# EAGLE design rx_mod (EAGLE 7.4.0)
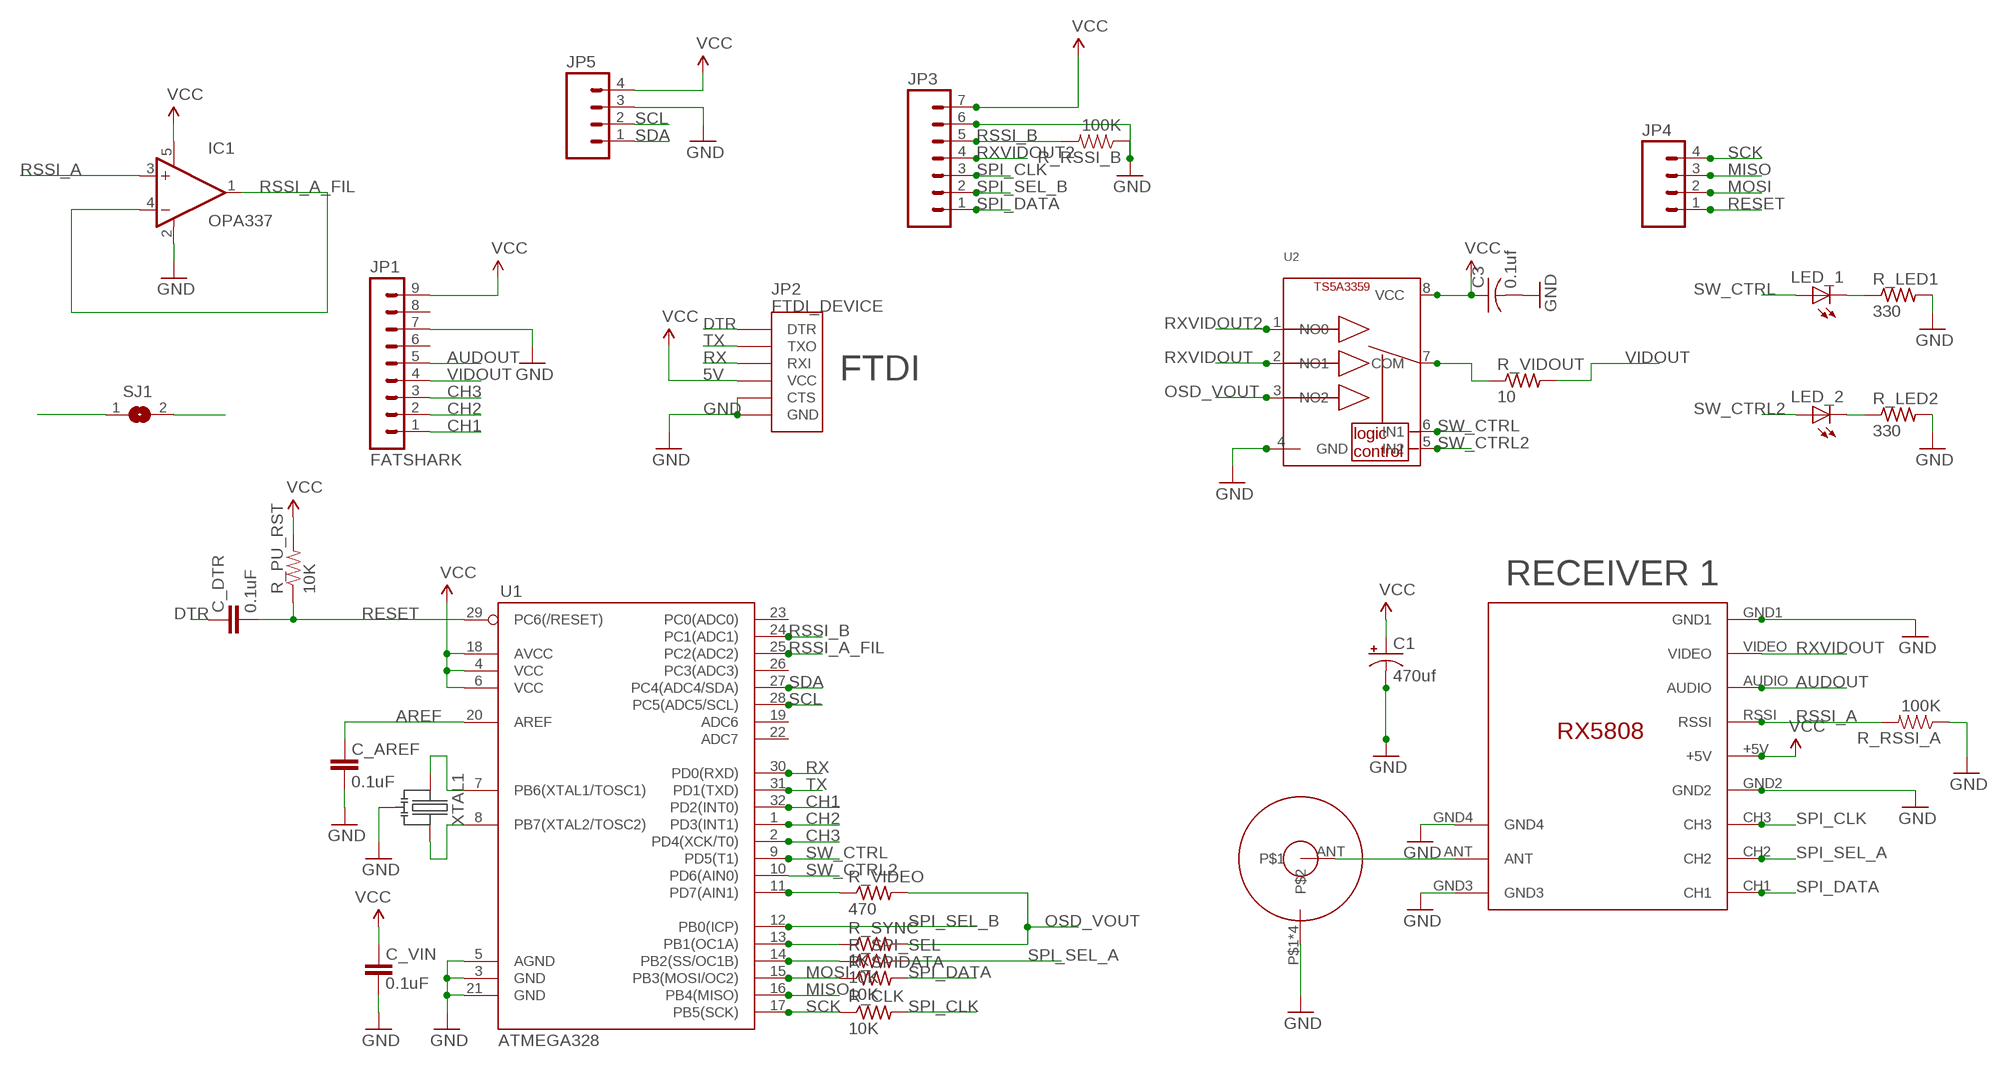
[diagram p0: schematic, sheet 1]

## Parts
C1  470uf  CAP_POL7343  [EIA7343]
C3  0.1uf  C-USC0603  [C0603]
C_AREF  0.1uF  CAP0603-CAP  [0603-CAP]
C_DTR  0.1uF  CAP0603-CAP  [0603-CAP]
C_VIN  0.1uF  CAP0603-CAP  [0603-CAP]
IC1  OPA336N  [SOT23-5]
JP1  FATSHARK  MA09-1  [MA09-1]
JP2  FTDI_DEVICE  [FTDI_DEVICE_SIDE]
JP3  M07  [1X07]
JP4  M04PTH  [1X04]
JP5  M04PTH  [1X04]
LED_1  LEDSML0603  [SML0603]
LED_2  LEDSML0603  [SML0603]
R_CLK  10K  R-US_R0805  [R0805]
R_LED1  330  R-US_R0603  [R0603]
R_LED2  330  R-US_R0603  [R0603]
R_PU_RST  10K  RESISTOR0603-RES  [0603-RES]
R_RSSI_A  100K  RESISTOR0603-RES  [0603-RES]
R_RSSI_B  100K  RESISTOR0603-RES  [0603-RES]
R_SPI_SEL  10K  R-US_R0805  [R0805]
R_SPIDATA  10K  R-US_R0805  [R0805]
R_SYNC  1K  R-US_R0805  [R0805]
R_VIDEO  470  R-US_R0805  [R0805]
R_VIDOUT  10  R-US_R0805  [R0805]
RECEIVER_A  RX5808_A  RX5808  [RX5808]
SJ1  SJ  [SJ]
U1  ATMEGA328  ATMEGA168  [TQFP32-08]
U2  TS5A3359  [VFSOP-8]
U$1  SMA_ANTENNA  [SMA_CONNECTOR]
XTAL1  CSTCE16M0V53-R0  [CSTCE16M0V53-R0]

## Nets
5V: C1.A(+) C3.1 C_VIN.2 IC1.5(V+) JP1.9 JP2.P$4(VCC) JP3.7 JP5.4 R_PU_RST.2 RECEIVER_A.+5V U1.4(VCC) U1.6(VCC) U1.18(AVCC) U2.8(VCC) ; supply symbol labelled VCC
AREF: C_AREF.2 U1.20(AREF)
AUDOUT: JP1.5 RECEIVER_A.AUDIO
CH1: JP1.1 U1.32(PD2(INT0))
CH2: JP1.2 U1.1(PD3(INT1))
CH3: JP1.3 U1.2(PD4(XCK/T0))
DTR: C_DTR.2 JP2.P$1(DTR)
GND: C1.C(-) C3.2 C_AREF.1 C_VIN.1 IC1.2(V-) JP1.7 JP2.P$5(CTS) JP2.P$6(GND) JP3.6 JP5.3 R_LED1.2 R_LED2.2 R_RSSI_A.1 R_RSSI_B.1 RECEIVER_A.GND1 RECEIVER_A.GND2 RECEIVER_A.GND3 RECEIVER_A.GND4 U1.3(GND) U1.5(AGND) U1.21(GND) U2.4(GND) U$1.P$1 U$1.P$2 U$1.P$3 U$1.P$4 XTAL1.2
MISO: JP4.3 U1.16(PB4(MISO))
MOSI: JP4.2 R_SPIDATA.1 U1.15(PB3(MOSI/OC2))
N$1: U1.8(PB7(XTAL2/TOSC2)) XTAL1.3
N$2: U1.7(PB6(XTAL1/TOSC1)) XTAL1.1
N$3: LED_1.C R_LED1.1
N$4: R_SPI_SEL.1 U1.14(PB2(SS/OC1B))
N$5: RECEIVER_A.ANT U$1.ANT
N$6: R_VIDOUT.1 U2.7(COM)
N$9: R_SYNC.1 U1.13(PB1(OC1A))
N$10: R_VIDEO.1 U1.11(PD7(AIN1))
N$11: LED_2.C R_LED2.1
OSD_VOUT: R_SYNC.2 R_VIDEO.2 U2.3(NO2)
RESET: C_DTR.1 JP4.1 R_PU_RST.1 U1.29(PC6(/RESET))
RSSI_A: IC1.3(+IN) R_RSSI_A.2 RECEIVER_A.RSSI SJ1.1
RSSI_A_FIL: IC1.1(OUT) IC1.4(-IN) SJ1.2 U1.25(PC2(ADC2))
RSSI_B: JP3.5 R_RSSI_B.2 U1.24(PC1(ADC1))
RX: JP2.P$3(RXI) U1.30(PD0(RXD))
RXVIDOUT: RECEIVER_A.VIDEO U2.2(NO1)
RXVIDOUT2: JP3.4 U2.1(NO0)
SCK: JP4.4 R_CLK.1 U1.17(PB5(SCK))
SCL: JP5.2 U1.28(PC5(ADC5/SCL))
SDA: JP5.1 U1.27(PC4(ADC4/SDA))
SPI_CLK: JP3.3 R_CLK.2 RECEIVER_A.CH3
SPI_DATA: JP3.1 R_SPIDATA.2 RECEIVER_A.CH1
SPI_SEL_A: R_SPI_SEL.2 RECEIVER_A.CH2
SPI_SEL_B: JP3.2 U1.12(PB0(ICP))
SW_CTRL: LED_1.A U1.9(PD5(T1)) U2.6(IN1)
SW_CTRL2: LED_2.A U1.10(PD6(AIN0)) U2.5(IN2)
TX: JP2.P$2(TXO) U1.31(PD1(TXD))
VIDOUT: JP1.4 R_VIDOUT.2
Unconnected: JP1.6 JP1.8 U1.19(ADC6) U1.22(ADC7) U1.23(PC0(ADC0)) U1.26(PC3(ADC3))

## Notes on the sheet
- OPA337
- FTDI
- RECEIVER 1

## Library data of the parts
C1 = SparkFun-Passives:CAP_POL: Capacitor Polarized These are standard SMD and PTH capacitors. Normally 10uF, 47uF, and 100uF in electrolytic and tantalum varieties. Always verify the external diameter of the through hole cap, it varies with capacity, voltage, and manufacturer. The EIA devices should be standard.
C3 = adafruit:C-US: CAPACITOR, American symbol
C_AREF C_DTR C_VIN = SparkFun:CAP: Capacitor Standard 0603 ceramic capacitor, and 0.1" leaded capacitor.
IC1 = burr-brown:OPA336: CMOS Operational Amplifiers Single-Supply, MicroPower, MicroAmplifier(TM) Series; MPN: OPA336NA; OC_FARNELL: 1212297; OC_NEWARK: 01M8405
JP1 = con-lstb:MA09-1: PIN HEADER; OC_FARNELL: unknown; OC_NEWARK: unknown
JP2 = SparkFun-Connectors:FTDI_DEVICE: Connector which mates to FTDI basic or FTDI cable.
JP3 = SparkFun-Connectors:M07: Header 7 Standard 7-pin 0.1" header. Use with straight break away headers (SKU : PRT-00116), right angle break away headers (PRT-00553), swiss pins (PRT-00743), machine pins (PRT-00117), and female headers (PRT-00115). NOTES ON THE VARIANTS LOCK and LOCK_LONGPADS... This footprint was designed to help hold the alignment of a through-hole component (i.e. 7-pin header) while soldering it into place. You may notice that each hole has been shifted either up or down by 0.005 of an inch from it's more standard position (which is usually a perfectly straight line). This slight alteration caused the pins (the squares in the middle) to touch the edges of the holes. Because they are alternating, it causes a "brace" to hold the header in place. 0.005 has proven to be the perfect amount of "off-center" position when using our standard breakaway headers. Although looks a little odd when you look at the bare footprint, once you have a header in there, the alteration is very hard to notice. Also, if you push a header all the way into place, it is covered up entirely on the bottom side. This idea of altering the position of holes to aid alignment will be further integrated into the Sparkfun Library for other footprints. It can help hold any component with 3 or more connection pins.
JP4 JP5 = SparkFun-Connectors:M04: Header 4 Standard 4-pin 0.1" header. Use with straight break away headers (SKU : PRT-00116), right angle break away headers (PRT-00553), swiss pins (PRT-00743), machine pins (PRT-00117), and female headers (PRT-00115). Molex polarized connector foot print use with SKU : PRT-08231 with associated crimp pins and housings. 1MM SMD Version SKU: PRT-10208
LED_1 LED_2 = led:LED: LED OSRAM: - CHIPLED LG R971, LG N971, LY N971, LG Q971, LY Q971, LO R971, LY R971 LH N974, LH R974 LS Q976, LO Q976, LY Q976 LO Q996 - Hyper CHIPLED LW Q18S LB Q993, LB Q99A, LB R99A - SideLED LS A670, LO A670, LY A670, LG A670, LP A670 LB A673, LV A673, LT A673, LW A673 LH A674 LY A675 LS A676, LA A676, LO A676, LY A676, LW A676 LS A679, LY A679, LG A679 - Hyper Micro SIDELED® LS Y876, LA Y876, LO Y876, LY Y876 LT Y87S - SmartLED LW L88C, LW L88S LB L89C, LB L89S, LG L890 LS L89K, LO L89K, LY L89K LS L896, LA L896, LO L896, LY L896 - TOPLED LS T670, LO T670, LY T670, LG T670, LP T670 LSG T670, LSP T670, LSY T670, LOP T670, LYG T670 LG T671, LOG T671, LSG T671 LB T673, LV T673, LT T673, LW T673 LH T674 LS T676, LA T676, LO T676, LY T676, LB T676, LH T676, LSB T676, LW T676 LB T67C, LV T67C, LT T67C, LS T67K, LO T67K, LY T67K, LW E67C LS E67B, LA E67B, LO E67B, LY E67B, LB E67C, LV E67C, LT E67C LW T67C LS T679, LY T679, LG T679 LS T770, LO T770, LY T770, LG T770, LP T770 LB T773, LV T773, LT T773, LW T773 LH T774 LS E675, LA E675, LY E675, LS T675 LS T776, LA T776, LO T776, LY T776, LB T776 LHGB T686 LT T68C, LB T68C - Hyper Mini TOPLED® LB M676 - Mini TOPLED Santana® LG M470 LS M47K, LO M47K, LY M47K Source: http://www.osram.convergy.de LUXEON: - LUMILED® LXK2-PW12-R00, LXK2-PW12-S00, LXK2-PW14-U00, LXK2-PW14-V00 LXK2-PM12-R00, LXK2-PM12-S00, LXK2-PM14-U00 LXK2-PE12-Q00, LXK2-PE12-R00, LXK2-PE12-S00, LXK2-PE14-T00, LXK2-PE14-U00 LXK2-PB12-K00, LXK2-PB12-L00, LXK2-PB12-M00, LXK2-PB14-N00, LXK2-PB14-P00, LXK2-PB14-Q00 LXK2-PR12-L00, LXK2-PR12-M00, LXK2-PR14-Q00, LXK2-PR14-R00 LXK2-PD12-Q00, LXK2-PD12-R00, LXK2-PD12-S00 LXK2-PH12-R00, LXK2-PH12-S00 LXK2-PL12-P00, LXK2-PL12-Q00, LXK2-PL12-R00 Source: www.luxeon.com KINGBRIGHT: KA-3528ASYC Source: www.kingbright.com
R_CLK R_LED1 R_LED2 R_SPI_SEL R_SPIDATA R_SYNC R_VIDEO R_VIDOUT = rcl:R-US_: RESISTOR, American symbol
R_PU_RST R_RSSI_A R_RSSI_B = SparkFun:RESISTOR: Resistor Basic schematic elements and footprints for 0603, 1206, and PTH resistors.
RECEIVER_A = 1customstuff:RX5808
SJ1 = jumper:SJ: SMD solder JUMPER
U1 = SparkFun:ATMEGA168
U2 = ts5a3359:TS5A3359: 74AUP2G126 - Low-Power Dual Tri-State Buffer OE high enables output. For OE Low enabled output use 74AUP2G125. VCC: 0.8-3.6V Temp: -40°C - 125°C Package Variant: 8-VSSOP (SOT765-1) Manuf. ID: 74AUP2G126DC,125 Digikey: 568-4987-1-ND NOTE: Make sure to check the propogation delay to see if it's short enough for your timing since it's largely dependant on the line capacitance and supply voltage!
U$1 = #fpv:SMA_ANTENNA
XTAL1 = CSTCE16M0V53-R0:CSTCE16M0V53-R0

## Net classes
0 default: width 0.254 mm, clearance 0.254 mm
1 vcc: width 0.254 mm
2 gnd: width 0.305 mm, drill 0.559 mm, clearance 0.254 mm
3 usbvcc: width 0.508 mm, drill 0.61 mm, clearance 0.254 mm

## Board
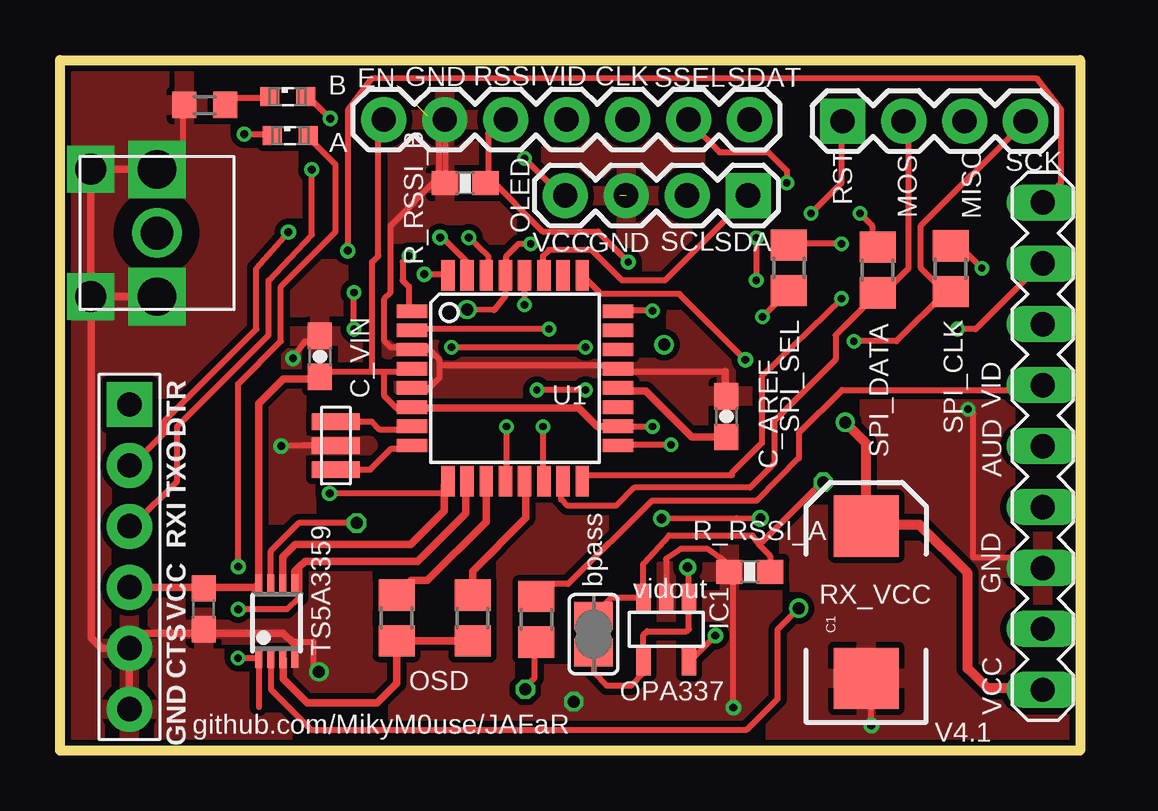
[diagram p1: board, top side]
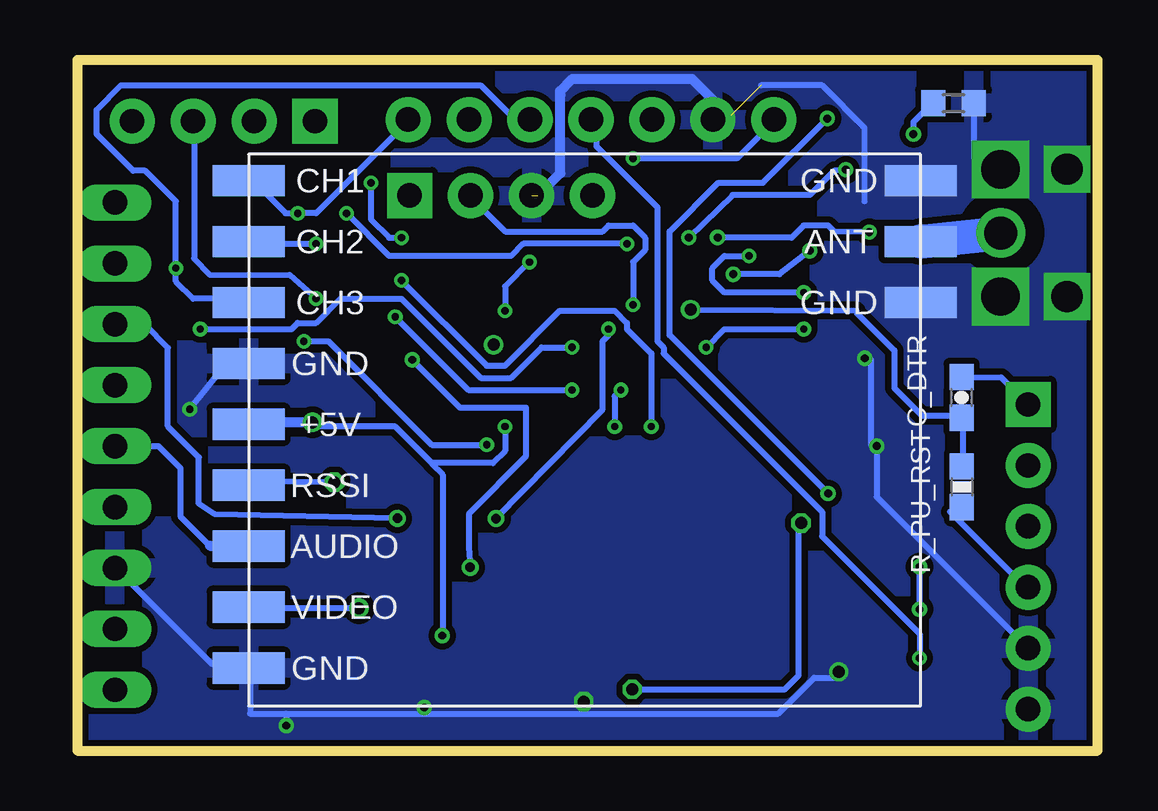
[diagram p2: board, bottom side, seen from below]

Size 42.51 x 28.8 mm. Coordinates in mm from the lower left corner, seen from the top.
Outline: 0,0 0,28.8 42.51,28.8 42.51,0 0,0
Copper layers (1*16): Top 0.035mm / dielectric 1.5mm / Bottom 0.035mm
Design rules "dirt_cheap_dirty_boards.v1": minimum track width 5mil, minimum drill 12mil, track to track 5mil, track to pad 5mil, pad to pad 5mil, via to via 5mil, smd to smd 0mil, copper to edge 10mil, drill to drill 10mil, minimum pad ring 10mil, minimum via ring 6mil, stop-mask expansion 2mil, vias tented up to drill 25mil, thermal gap 10mil
tRestrict: area 2.7,20.3 to 5.4,22.9
bRestrict: area 2.7,20.3 to 5.4,22.9

### Footprints (pad centres in the part's own frame; a part is rotated, then mirrored left to right if it is on the bottom)
EIA7343 = smd 2.55 x 2.7: A 3.17,0; C -3.17,0
C0603 = smd 1.1 x 1: 1 -0.85,0; 2 0.85,0
0603-CAP = smd 1.1 x 1: 1 -0.85,0; 2 0.85,0
SOT23-5 = smd 0.6 x 1.2: 1 -0.95,-1.306; 2 0,-1.306; 3 0.95,-1.306; 4 0.95,1.306; 5 -0.95,1.306
MA09-1 = drill 1.016 long: 1 -10.16,0; 2 -7.62,0; 3 -5.08,0; 4 -2.54,0; 5 0,0; 6 2.54,0; 7 5.08,0; 8 7.62,0; 9 10.16,0
FTDI_DEVICE_SIDE = drill 1.016 pad 1.88 square: P$1 -6.35,0 | drill 1.016 pad 1.88: P$2 -3.81,0; P$3 -1.27,0; P$4 1.27,0; P$5 3.81,0; P$6 6.35,0
1X07 = drill 1.016 pad 1.88: 1 0,0; 2 2.54,0; 3 5.08,0; 4 7.62,0; 5 10.16,0; 6 12.7,0; 7 15.24,0
1X04 = drill 1.016 pad 1.88 square: 1 0,0 | drill 1.016 pad 1.88: 2 2.54,0; 3 5.08,0; 4 7.62,0
SML0603 = smd 0.8 x 0.8: A 0.75,0; C -0.75,0
R0805 = smd 1.3 x 1.5: 1 -0.95,0; 2 0.95,0
R0603 = smd 1 x 1.1: 1 -0.85,0; 2 0.85,0
0603-RES = smd 1.1 x 1: 1 -0.85,0; 2 0.85,0
RX5808 = smd 3 x 1.3: +5V 28,11.26; ANT 0,3.64; AUDIO 28,16.34; CH1 28,1.1; CH2 28,3.64; CH3 28,6.18; GND1 28,21.42; GND2 28,8.72; GND3 0,1.1; GND4 0,6.18; RSSI 28,13.8; VIDEO 28,18.88
SJ = smd 1.168 x 1.6: 1 -0.762,0; 2 0.762,0
TQFP32-08 = smd 1.27 x 0.559: 1 -4.293,2.8; 2 -4.293,2; 3 -4.293,1.2; 4 -4.293,0.4; 5 -4.293,-0.4; 6 -4.293,-1.2; 7 -4.293,-2; 8 -4.293,-2.8; 17 4.293,-2.8; 18 4.293,-2; 19 4.293,-1.2; 20 4.293,-0.4; 21 4.293,0.4; 22 4.293,1.2; 23 4.293,2; 24 4.293,2.8 | smd 0.559 x 1.27: 9 -2.8,-4.293; 10 -2,-4.293; 11 -1.2,-4.293; 12 -0.4,-4.293; 13 0.4,-4.293; 14 1.2,-4.293; 15 2,-4.293; 16 2.8,-4.293; 25 2.8,4.293; 26 2,4.293; 27 1.2,4.293; 28 0.4,4.293; 29 -0.4,4.293; 30 -1.2,4.293; 31 -2,4.293; 32 -2.8,4.293
VFSOP-8 = smd 0.3 x 0.8: 1 0,0; 2 0.5,0; 3 1,0; 4 1.5,0; 5 1.5,3.1; 6 1,3.1; 7 0.5,3.1; 8 0,3.1
SMA_CONNECTOR = drill 1.37: ANT -0.02,-0.017 | drill 1.3 square: P$1 -2.67,2.743; P$2 2.64,2.743 | drill 1.6 square: P$3 -2.67,-0.017; P$4 2.64,-0.017
CSTCE16M0V53-R0 = smd 0.7 x 2: 1 -1,0; 2 0,0; 3 1,0

### Placement (x,y rotation side)
C1  33.59,6.19 90 top
C3  5.98,5.92 270 top
C_AREF  27.77,13.93 270 top
C_DTR  5.66,14.73 90 bottom
C_VIN  10.83,16.44 270 top
IC1  25.26,5.06 180 top
JP1  40.95,12.7 270 top
JP2  2.9,8.09 270 top
JP3  28.73,26.32 180 top
JP4  32.61,26.25 0 top
JP5  28.67,23.15 180 top
LED_1  9.49,27.26 0 top
LED_2  9.59,25.65 0 top
R_CLK  37.11,20.1 90 top
R_LED1  6.03,26.92 180 top
R_LED2  6.01,27 0 bottom
R_PU_RST  5.66,11 270 bottom
R_RSSI_A  28.74,7.46 0 top
R_RSSI_B  16.88,23.66 0 top
R_SPI_SEL  30.37,20.14 90 top
R_SPIDATA  34.07,20.04 90 top
R_SYNC  17.19,5.53 270 top
R_VIDEO  14.03,5.54 270 top
R_VIDOUT  19.85,5.48 90 top
RECEIVER_A  7.38,24.87 180 bottom
SJ1  22.23,4.86 270 top
U1  18.96,15.53 0 top
U2  8.29,3.85 0 top
U$1  4.02,21.61 90 top
XTAL1  11.49,12.72 270 top

### Tracks (layer width: path | path; a pad name or v marks a point on that pad's centre or on a via)
5V  (via drill 0.3, 0.33, 0.5)
  Top 0.254: 13.01,15.8 10.98,15.8 C_VIN.2 | 13.01,15.8 13.52,15.8 | 13.52,15.8 14.53,15.8 U1.4 | 13.01,15.8 13.01,20.37 13.26,20.63 13.26,26.22 JP3.7 | 13.52,15.8 13.52,14.79 14.03,14.28 14.53,14.28 U1.6 | v24.69,13.52 23.42,13.52 U1.18 | C3.1 2.96,6.75 JP2.P$4 | v27.31,4.8 26.31,3.8 IC1.5 | v19.36,24.69 20.88,23.17 JP5.4
  Top 0.305: C_VIN.2 10.74,15.5 9.31,15.5 8.29,14.48 U2.8 8.14,6.81 JP2.P$4 | U1.18 22.38,13.53 21.61,14.3 14.69,14.3 U1.6
  Top 0.406: 34.15,9.36 C1.A 33.59,12.82 v32.72,13.69 | 34.15,9.36 34.65,9.36 | 41.45,2.55 41.5,2.6 41.01,2.6 | 41.01,2.6 JP1.9 | 41.01,2.6 38.65,2.6 37.82,3.43 37.82,7.41 35.81,9.42 34.21,9.42 34.15,9.36
  Bottom 0.254: R_PU_RST.2 6.15,9.96 3.1,6.91 JP2.P$4 | 27.74,11.99 29.27,13.52 32.57,13.52 v32.72,13.69 | 27.74,11.99 25.2,11.99 24.69,12.5 v24.69,13.52 | 27.74,11.99 27.74,11.96 27.29,11.51 27.29,4.82 v27.31,4.8 | v19.36,24.69 15.04,24.69 13.52,26.22 JP3.7
  Bottom 0.406: v32.72,13.69 35.21,13.69 RECEIVER_A.+5V
AREF
  Top 0.305: C_AREF.2 26.33,13.08 24.41,15 23.38,15 U1.20
AUDOUT
  Bottom 0.254: JP1.5 39.14,12.7 38.22,11.78 38.22,9.77 36.99,8.54
  Bottom 0.406: 36.99,8.54 35.28,8.54 RECEIVER_A.AUDIO
CH1  (via drill 0.33)
  Top 0.254: v15.18,19.87 16.06,19.87 U1.32 | v11.99,20.85 11.99,26.71 12.97,28.02 40.7,28.03 41.71,26.72 41.71,23.68 40.95,22.91 JP1.1
  Bottom 0.254: v15.18,19.87 13.26,19.87 v11.99,20.85
CH2  (via drill 0.3)
  Top 0.254: v14.53,20.63 14.28,20.37 14.28,19.61 14.53,19.36 14.53,18.34 U1.1 | v12.25,17.58 v12.25,19.1 | v21.9,16.82 v16.31,16.82 | v37.39,17.58 38.16,17.58 40.95,20.37 JP1.2
  Bottom 0.254: v14.53,20.63 15.55,20.63 16.06,20.12 16.06,19.61 15.55,19.1 v12.25,19.1 | v12.25,17.58 15.55,17.58 v16.31,16.82 | v21.9,16.82 23.17,16.82 24.44,15.55 25.71,15.55 29.01,18.85 31.55,18.85 32.57,17.83 33.33,17.83 33.58,17.58 v37.39,17.58
CH3  (via drill 0.3, 0.4)
  Top 0.254: v20.38,17.58 14.79,17.58 U1.2 | v25.07,9.68 28.19,9.7 v29.18,9.69
  Bottom 0.254: v20.38,17.58 20.38,17.33 20.63,17.07 20.63,14.23 v25.07,9.68 | 40.95,17.83 JP1.3 40.93,17.76 39.7,17.76 38.74,16.8 38.74,13.52 37.45,12.23 37.45,10.3 36.78,9.86 v29.18,9.69
DTR
  Bottom 0.254: C_DTR.2 4.02,15.56 JP2.P$1
GND  (via drill 0.3, 0.33, 0.5)  (2 unrouted)
  Top 0.254: XTAL1.2 10.09,12.72 v9.21,12.7 | 15.8,16.06 15.8,16.31 15.3,16.82 14.79,16.82 U1.3 14.53,16.82 13.77,16.82 13.52,17.07 13.52,18.85 13.77,19.1 13.77,21.9 15.8,23.93 15.8,26.22 JP3.6 16.06,26.22 16.06,23.68 R_RSSI_B.1 | 15.8,16.06 15.8,15.55 15.3,15.04 14.79,15.04 U1.5 | 15.8,16.06 23.17,16.06 U1.21 23.42,15.8 27.72,15.8 27.74,15.8 | R_LED1.2 5.14,26.72 5.14,24.69 4.63,24.18 U$1.P$4 | v9.71,16.36 10.22,17.07 10.72,17.07 C_VIN.1 | 33.58,3.1 C1.C 33.81,2.8 v33.81,1.05 | 40.95,7.67 JP1.7 40.81,7.8 40.56,8.05 38.06,8.05 38.06,14.05 v37.83,14.24 | v10.79,3.29 10.56,3.3 10.56,4.55 9.81,4.55 9.74,4.47 | C3.2 6.06,5.05 6.06,4.9 | v28.06,1.8 28.06,7.3 R_RSSI_A.1 27.89,7.77 26.96,8.42 25.88,8.42 25.25,7.99 IC1.2
  Top 0.305: JP2.P$6 JP2.P$5 | JP2.P$5 1.74,4.27 1.31,4.7 1.31,18.39 U$1.P$1 | U$1.P$1 U$1.P$3 | U$1.P$1 U$1.P$2 U$1.P$4 | U2.4 9.79,4.42 9.74,4.47 9.31,4.9 6.06,4.9 3.52,4.9 JP2.P$5 | 27.72,15.8 27.72,14.83 C_AREF.1
  Bottom 0.254: JP2.P$5 9.21,10.59 v9.21,12.7 9.45,12.75 9.45,16.31 v9.71,16.36 | 5.14,24.69 5.14,26.98 R_LED2.2 | 5.14,24.69 4.63,24.18 U$1.P$4 5.14,24.69 | 15.3,26.47 15.8,26.47 JP3.6 | 14.03,27.74 11.49,27.74 9.71,25.96 9.71,22.91 | JP1.7 40.95,7.67 36.89,3.61 35.36,3.61 RECEIVER_A.GND1 35.31,3.3 35.31,1.55 33.81,1.55 | v37.83,14.24 36.38,16.06 35.36,16.06 RECEIVER_A.GND2 | 33.81,1.55 28.06,1.55 | 28.06,1.55 13.31,1.55 11.81,3.05 10.81,3.05 v10.79,3.29 | 28.06,1.55 v28.06,1.8 | 33.81,1.55 v33.81,1.05
  Bottom 0.406: 23.32,23.15 22.39,24.08 22.39,27.34 22.4,27.35 22.4,27.5 21.89,28.01 16.91,28.01 15.92,27.02 15.92,26.43 JP3.6
  other vias: 21.41,2.05
  pour Bottom (isolate 0.406): 0.85,24.74 9.96,24.74 9.96,17.1 0.31,17.1
  pour Bottom (isolate 0.254): 0.31,-0.2 43.31,-0.2 43.31,29.8 0.31,29.8
  pour Top (isolate 0.254): 0.31,-0.2 43.31,-0.2 43.31,29.8 0.31,29.8
MISO  (via drill 0.3)
  Top 0.254: v32.57,18.85 29.25,15.62 29.25,12.83 28,11.57 28,11.48 21.9,11.48 U1.16
  Bottom 0.254: v32.57,18.85 33.67,19.84 37,19.85 37.65,20.52 37.65,26.22 JP4.3
MOSI
  Top 0.254: U1.15 20.88,11.23 20.88,10.47 21.14,10.21 23.17,10.21 23.93,10.98 28.76,10.98 29.77,11.99 29.77,13.77 32.31,16.31 32.31,17.33 33.84,18.85 R_SPIDATA.1 34.09,18.85 35.36,20.12 35.36,26.22 JP4.2
N$1
  Top 0.254: XTAL1.3 12.93,11.72 13.81,12.6 14.54,12.6 U1.8
N$2
  Top 0.254: XTAL1.1 12.99,13.72 13.31,13.4 14.54,13.4 U1.7
N$3
  Top 0.254: LED_1.C 8.69,27.23 7.17,27.23 6.91,26.98 R_LED1.1
N$4  (via drill 0.3)
  Top 0.254: v20.12,13.52 20.12,11.48 U1.14 | v21.9,15.04 v19.87,15.04 | v29.27,18.09 30.28,19.1 R_SPI_SEL.1
  Bottom 0.254: v20.12,13.52 20.12,14.79 v19.87,15.04 | v21.9,15.04 26.22,15.04 v29.27,18.09
N$5
  Bottom 1.422: RECEIVER_A.ANT U$1.ANT
N$6  (via drill 0.5)
  Top 0.254: U2.7 8.79,8.33 9.95,9.49 v12.36,9.49 | v19.39,2.56 19.39,2.65 19.78,3.04 19.78,4.46 R_VIDOUT.1
  Bottom 0.254: v19.39,2.56 13.04,2.56 12.46,3.14 12.46,9.33 v12.36,9.49
N$7  (via drill 0.5)
  other vias: 25.17,16.93
N$9
  Top 0.305: R_SYNC.1 17.19,7.48 19.41,9.7 19.41,11.18 U1.13
N$10
  Top 0.305: U1.11 17.76,9.55 15.31,7.1 14.64,7.1 R_VIDEO.1
N$11  (via drill 0.33)
  Top 0.254: v7.68,25.71 8.69,25.71 LED_2.C
  Bottom 0.254: v7.68,25.71 7.68,26.22 6.91,26.98 R_LED2.1
OSD_VOUT
  Top 0.305: U2.3 9.31,3.83 9.31,3 10.31,2 13.21,2 14.03,2.82 R_VIDEO.2 R_SYNC.2
RESET  (via drill 0.3, 0.5)
  Top 0.254: v16.96,18.39 18.09,18.37 18.56,18.96 U1.29 18.6,19.87 18.6,20.63 19.11,21.14 v19.61,21.14 | v31.3,22.41 32.57,23.68 32.57,26.22 JP4.1
  Bottom 0.254: 5.63,13.95 5.63,13.86 | 5.63,13.86 5.63,11.92 R_PU_RST.1 | v16.96,18.39 10.05,18.35 10.05,18.27 8.47,16.69 8.47,15.12 7.32,13.97 5.79,13.97 C_DTR.1 5.65,13.88 5.63,13.86 | v31.3,22.41 29.52,20.63 24.44,20.63 23.93,21.14 v19.61,21.14
RSSI_A  (via drill 0.5)
  Top 0.254: 29.56,7.55 R_RSSI_A.2 29.59,8.12 29.12,8.59 | SJ1.1 22.97,6.37 IC1.3 24.31,7.81 24.32,7.81 25.38,8.98 28.84,8.98 29.12,8.59 | v31.8,11.19 31.73,11.19 29.12,8.59
  Bottom 0.254: v31.8,11.19 35.11,11.23 RECEIVER_A.RSSI
RSSI_A_FIL  (via drill 0.33, 0.4)
  Top 0.254: 26.06,6.3 IC1.1 | v28.56,16.3 25.81,19.05 22.56,19.05 21.81,19.8 U1.25 | v26.15,7.65 IC1.1 | IC1.1 26.2,6.36 26.2,5.07 26.11,4.98 24.46,4.98 24.31,4.83 IC1.4 24.31,3.22 23.8,2.71 22.78,2.71 22.25,3.24 22.25,4.08 SJ1.2
  Bottom 0.254: v28.56,16.3 26.56,14.3 23.81,14.3 23.81,12.3 26.2,9.87 26.2,8.48 v26.15,7.65
RSSI_B  (via drill 0.3)
  Top 0.254: 17.84,23.93 17.84,25.71 18.34,26.22 JP3.5 | 17.84,23.93 17.84,23.68 R_RSSI_B.2 17.84,23.93 | v24.69,18.34 23.42,18.34 U1.24 | v23.68,20.37 22.41,21.64 20.12,21.64 17.84,23.93
  Bottom 0.254: v24.69,18.34 24.69,19.36 v23.68,20.37
RX  (via drill 0.33)
  Top 0.254: v17.03,21.39 17.84,20.63 17.84,19.87 U1.30 | v10.49,24.22 10.49,21.51 8.69,19.61 8.69,17.33 4.88,13.52 4.88,11.23 3.1,9.45 JP2.P$3
  Bottom 0.254: v17.03,21.39 15.21,23.17 11.99,23.17 10.98,24.18 v10.49,24.22
RXVIDOUT  (via drill 0.5)
  Top 0.254: U2.2 8.79,2.56 10.47,0.88 28.62,0.88 29.9,2.16 29.9,5.06 v30.78,5.94
  Bottom 0.254: v30.78,5.94 35.14,5.94 RECEIVER_A.VIDEO
RXVIDOUT2  (via drill 0.3)
  Top 0.254: 8.29,1.82 U2.1 8.18,3.86 v7.42,3.86
  Bottom 0.254: v7.42,3.86 7.42,4.88 11.49,8.94 11.49,9.96 18.09,16.56 18.09,16.82 18.34,17.07 18.34,22.66 20.88,25.2 20.88,26.22 JP3.4
SCK  (via drill 0.3)
  Top 0.254: v25.46,12.75 23.42,12.75 U1.17 | v33.08,17.07 34.85,17.07 36.89,19.1 | 36.89,19.1 35.87,20.12 35.87,21.9 40.19,26.22 JP4.4 | 36.89,19.1 R_CLK.1
  Bottom 0.254: v25.46,12.75 27.74,12.75 32.06,17.07 v33.08,17.07
SCL  (via drill 0.3)
  Top 0.254: v19.36,18.6 19.36,19.61 U1.28
  Bottom 0.254: v19.36,18.6 19.36,20.37 18.85,20.88 18.85,21.39 19.36,21.9 20.38,21.9 20.63,21.64 24.69,21.64 25.96,22.91 JP5.2
SDA
  Top 0.254: U1.27 20.12,19.87 20.12,20.63 20.38,20.88 22.15,20.88 23.42,19.61 25.2,19.61 28.5,22.91 JP5.1
SPI_CLK  (via drill 0.3)
  Top 0.254: v38.41,20.12 37.65,20.88 37.14,20.88 R_CLK.2
  Bottom 0.254: 38.42,19.87 v38.41,20.12 | RECEIVER_A.CH3 35.36,18.85 37.69,18.85 38.41,19.57 v38.41,20.12 | v38.41,20.12 38.41,22.91 39.68,24.18 40.19,24.18 41.71,25.71 41.71,26.72 40.7,27.74 25.71,27.74 24.44,26.47 23.68,26.47 JP3.3
SPI_DATA  (via drill 0.3)
  Top 0.254: v33.33,22.41 33.84,21.9 33.84,21.14 R_SPIDATA.2
  Bottom 0.254: RECEIVER_A.CH1 35.11,23.68 33.84,22.41 v33.33,22.41 32.57,22.41 28.76,26.22 JP3.1
SPI_SEL_A  (via drill 0.3)
  Top 0.254: v32.57,21.14 30.54,21.14 R_SPI_SEL.2
  Bottom 0.254: v32.57,21.14 35.11,21.14 RECEIVER_A.CH2
SPI_SEL_B  (via drill 0.3)
  Top 0.254: v18.6,13.52 18.6,11.48 U1.12 | v29.01,21.39 v29.01,19.61 | v30.28,23.68 30.28,24.18 29.52,24.95 27.49,24.95 26.22,26.22 JP3.2
  Bottom 0.254: v18.6,13.52 18.6,16.56 19.61,17.58 19.61,17.83 20.12,18.34 22.41,18.34 24.69,16.06 25.46,16.06 v29.01,19.61 | v29.01,21.39 29.52,21.39 30.28,22.15 v30.28,23.68
SW_CTRL  (via drill 0.33)
  Top 0.254: v11.23,10.72 16.06,10.72 U1.9 | LED_1.A 10.47,27.23 10.47,27.15 v11.26,26.36
  Top 0.305: U2.6 9.29,8.08 9.81,8.6 14.61,8.6 16.01,10 16.01,11.08 U1.9
  Bottom 0.254: v11.23,10.72 17.84,17.33 17.84,21.64 15.8,23.68 13.95,23.68 v11.26,26.36
SW_CTRL2  (via drill 0.33)
  Top 0.254: v7.42,7.67 7.42,15.29 9.2,17.07 9.2,19.36 11.49,21.64 11.49,24.44 10.47,25.45 LED_2.A | v7.42,5.9 9.45,5.9 9.96,6.4 9.96,7.67 9.97,7.66
  Top 0.305: U2.5 9.79,7.47 9.97,7.66 10.21,7.9 14.91,7.9 16.91,9.9 16.91,11.18 U1.10
  Bottom 0.254: v7.42,5.9 v7.42,7.67
TX  (via drill 0.33)
  Top 0.254: v9.52,21.62 8.18,20.12 8.18,17.58 4.37,13.77 4.37,13.26 3.1,11.99 JP2.P$2 | 16.82,19.87 U1.31 16.96,20.38 15.95,21.39 v15.84,21.4
  Bottom 0.254: v15.84,21.4 12.76,21.39 12.25,21.9 11.23,21.9 10.98,21.64 v9.52,21.62
VIDOUT
  Top 0.254: R_VIDOUT.2 20.61,6.95 21.17,6.95 24.66,10.42 29.03,10.42 30.79,12.2 30.79,13.25 32.59,15.05 40.76,15.05 JP1.4

### Text on the board
tNames: EN | GND | B | RSSI | VID | CLK | SSEL | SDAT | A | SCK | RST | OLED | VCC | GND | SCL | SDA | MOSI | MISO | VID | SPI_SEL | SPI_CLK | SPI_DATA | AUD | bpass | vidout | GND | RX_VCC | TS5A3359 | OSD | OPA337 | VCC | github.com/MikyM0use/JAFaR | V4.1